# Altium schematic sheet MeasureMent.SchDoc
size A4; SheetNumber: 1; SheetTotal: 1
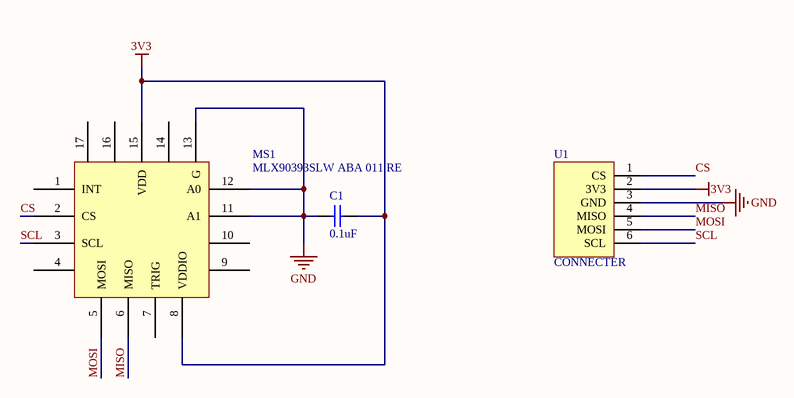
[diagram p0: MeasureMent.SchDoc]

## Parts
C1  0.1uF  [0603_C]
MS1  MLX90393SLW ABA 011 RE  [VQFN-16_EP_3.0x3.0xo.5P]
U1  CONNECTER  [CONNECTOR]

## Nets
3V3: C1.2 MS1.8(VDDIO) MS1.15(VDD) U1.2(3V3)
GND: C1.1 MS1.11(A1) MS1.12(A0) MS1.13(G) U1.3(GND)
CS: MS1.2(CS) U1.1(CS)
MISO: MS1.6(MISO) U1.4(MISO)
MOSI: MS1.5(MOSI) U1.5(MOSI)
SCL: MS1.3(SCL) U1.6(SCL)

Not connected (* = marked no-connect by the designer): MS1 1(INT) 4 7(TRIG) 9 10 14 16 17

## Library data of the parts
C1 = CAP_0.1uF: capacitance
MS1 = MLX90393SLW ABA 011 RE: sensor